# Altium schematic sheet Section_C_EXP.SchDoc
size A4
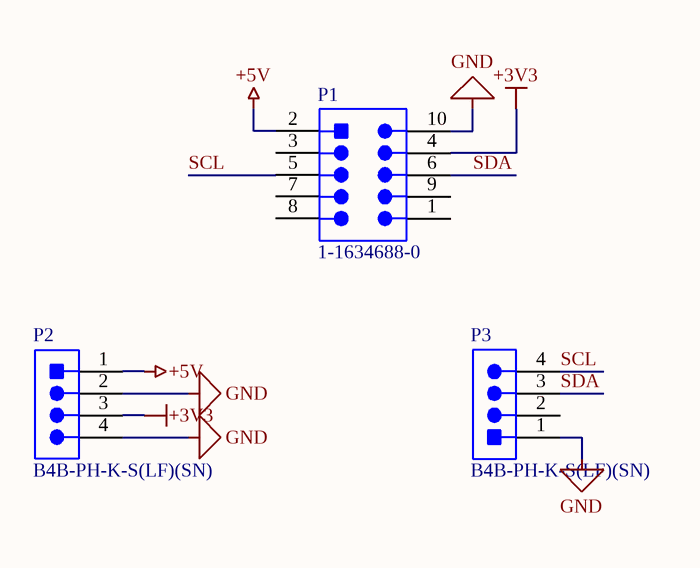
[diagram p0: Section_C_EXP.SchDoc]

## Parts
P1  1-1634688-0  [TECO-1-1634688-0-10_V]
P2  B4B-PH-K-S(LF)(SN)  [JST-B4B-PH-K-S_V]
P3  B4B-PH-K-S(LF)(SN)  [JST-B4B-PH-K-S_V]

## Nets
+3V3: P1.4 P2.3
+5V: P1.2 P2.1
GND: P1.10 P2.2 P2.4 P3.1
SCL: P1.5 P3.4
SDA: P1.6 P3.3

Not connected (* = marked no-connect by the designer): P1 1 3 7 8 9; P3 2

## Library data of the parts
P1 = CMP-2000-05854-1: Male Header, Pitch 2.54 mm, 2 x 5 Postion, Height 9.15 mm, Tail Length 3.2 mm, -40 to 105 degC, RoHS, Bulk; Manufacturer: TE Connectivity; No. of Rows: 2; SVHC: ToBeAdvised; Package Version: Rev. C2, 02/2011; No. of Contacts: 10Contacts; Pitch: 2.54mm; No. of Positions: 10; Contact Termination Type: ThroughHole; Package Description: 10-Pin Connector, Body 20.35 x 8.7 mm, Pitch 2.54 mm; Orientation: Straight; Gender: Header; Mounting Technology: ThroughHole; Product Range: -; PartNumber: 1-1634688-0; Datasheet Version: Rev. C2, 02/2011; Contact Material: Brass; Package URL: https://datasheet.ciiva.com/6831/eng-cd-1634688-c2-6831201.pdf; Package Reference: 1-1634688-0; Pitch Spacing: 2.54mm; Contact Plating: GoldPlatedContacts; Manufacturer URL: http://www.te.com/; Datasheet URL: https://datasheet.ciiva.com/6831/eng-cd-1634688-c2-6831201.pdf
P2 P3 = CMP-2000-05165-1: Male Header, Pitch 2 mm, 1 x 4 Position, Height 6 mm, Tail Length 3.4 mm, -25 to 85 degC, RoHS, Bulk; Manufacturer: JST; No of Positions: 4; Style/Orientation: StraightHeader/Plug; Pitch: 2mm; Datasheet URL: http://datasheet.octopart.com/B4B-PH-K-S%28LF%29%28SN%29-JST-datasheet-10558886.pdf; Type: ShroudedHeader; Manufacturer URL: http://www.jst.com/home2.html; Termination: Crimp; Datasheet Version: Apr-09